# EAGLE design GS_module (EAGLE 7.3.0)
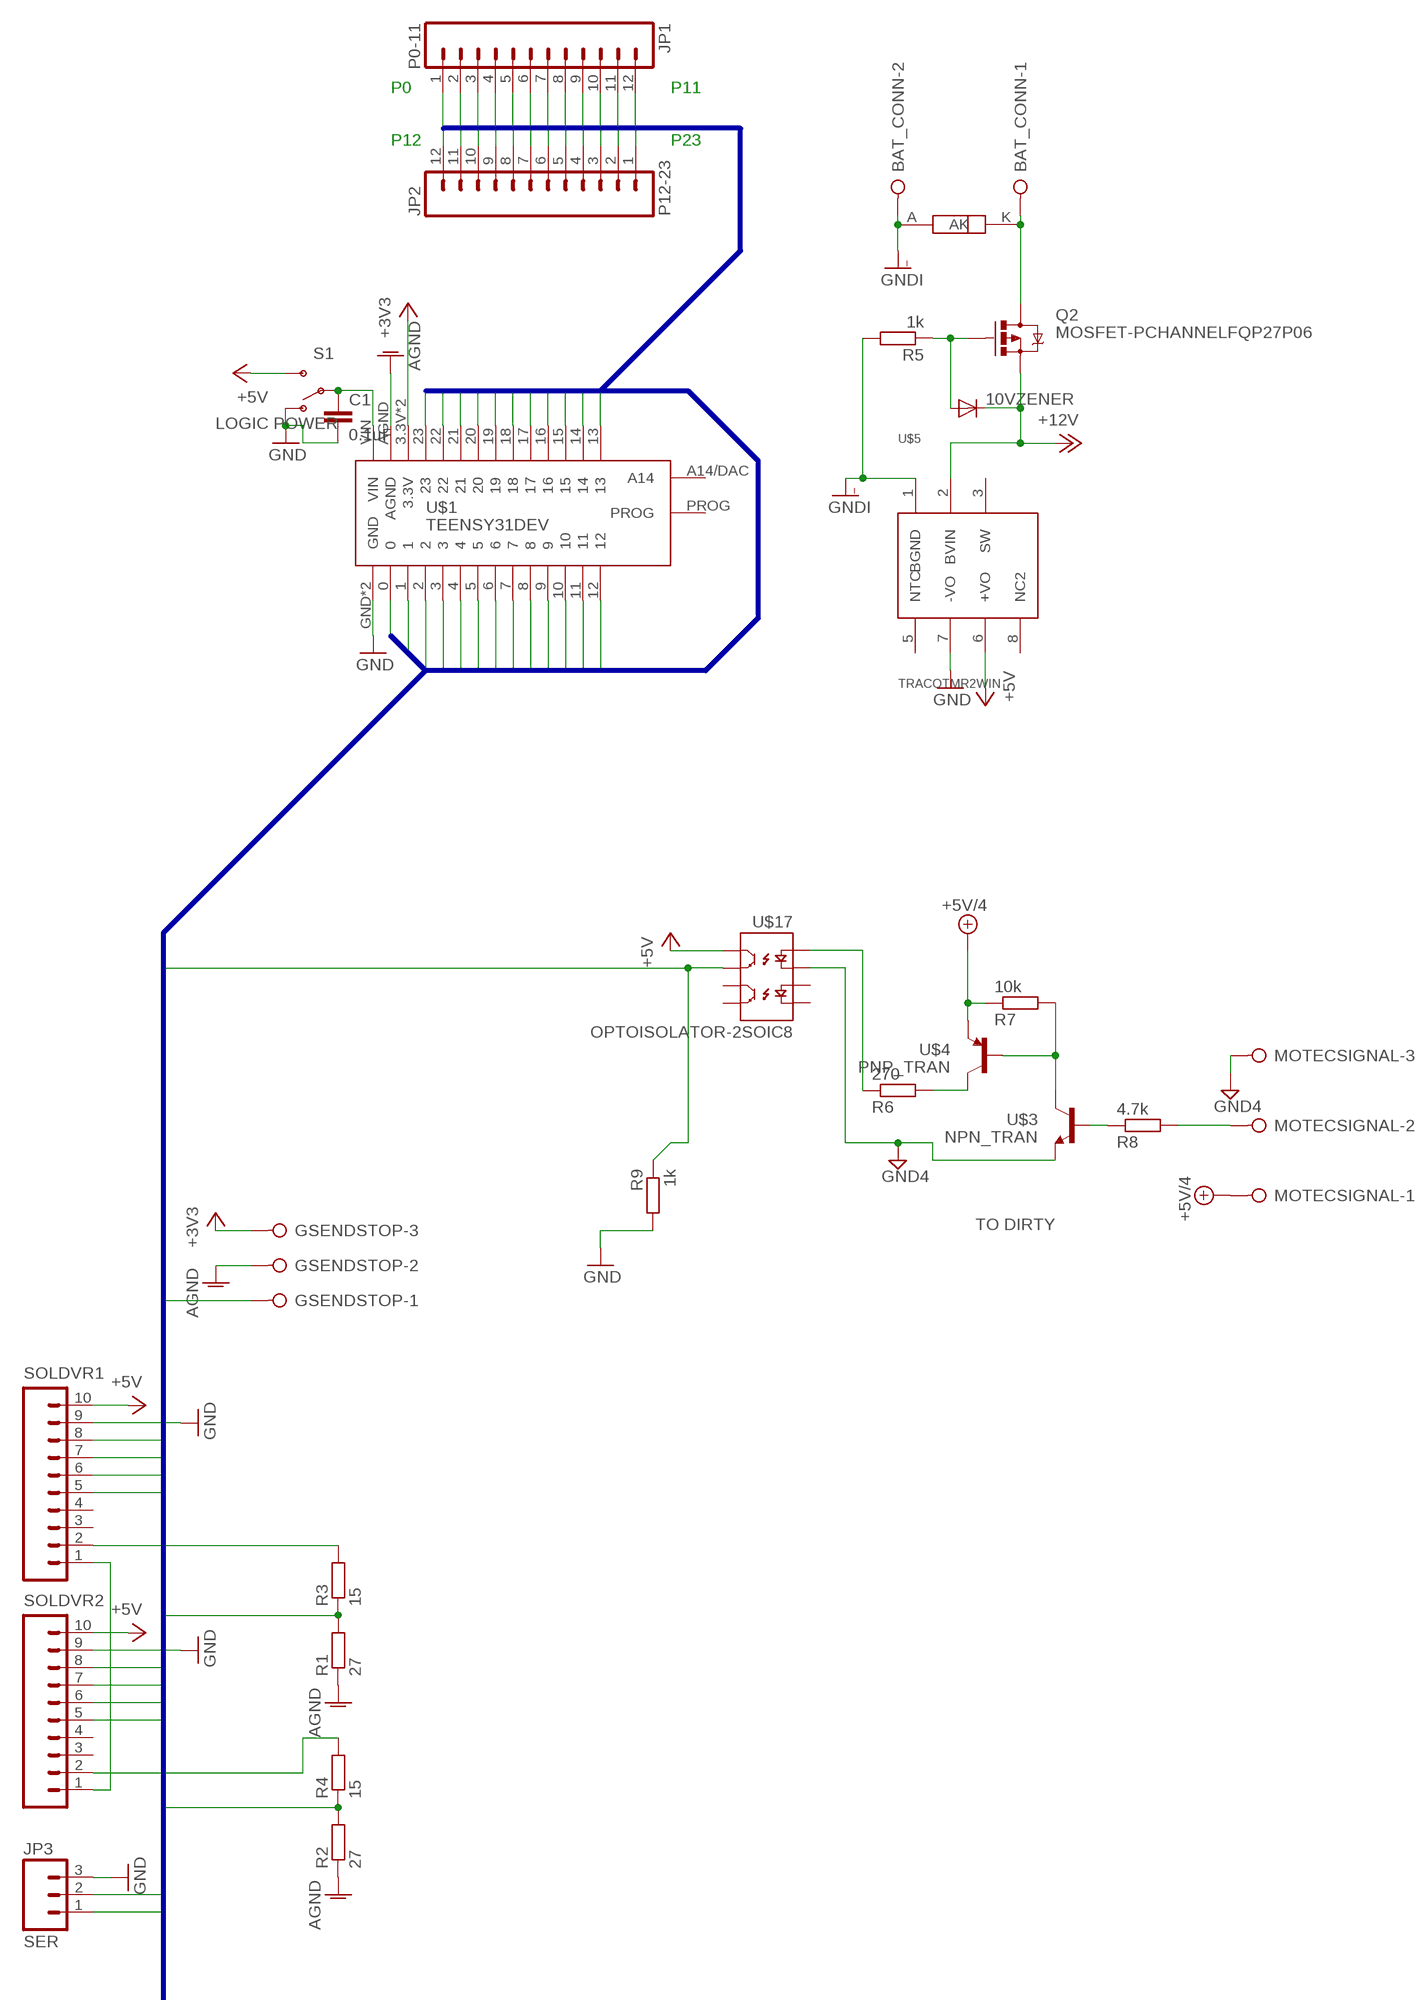
[diagram p0: schematic, sheet 1, part 1 of 2]
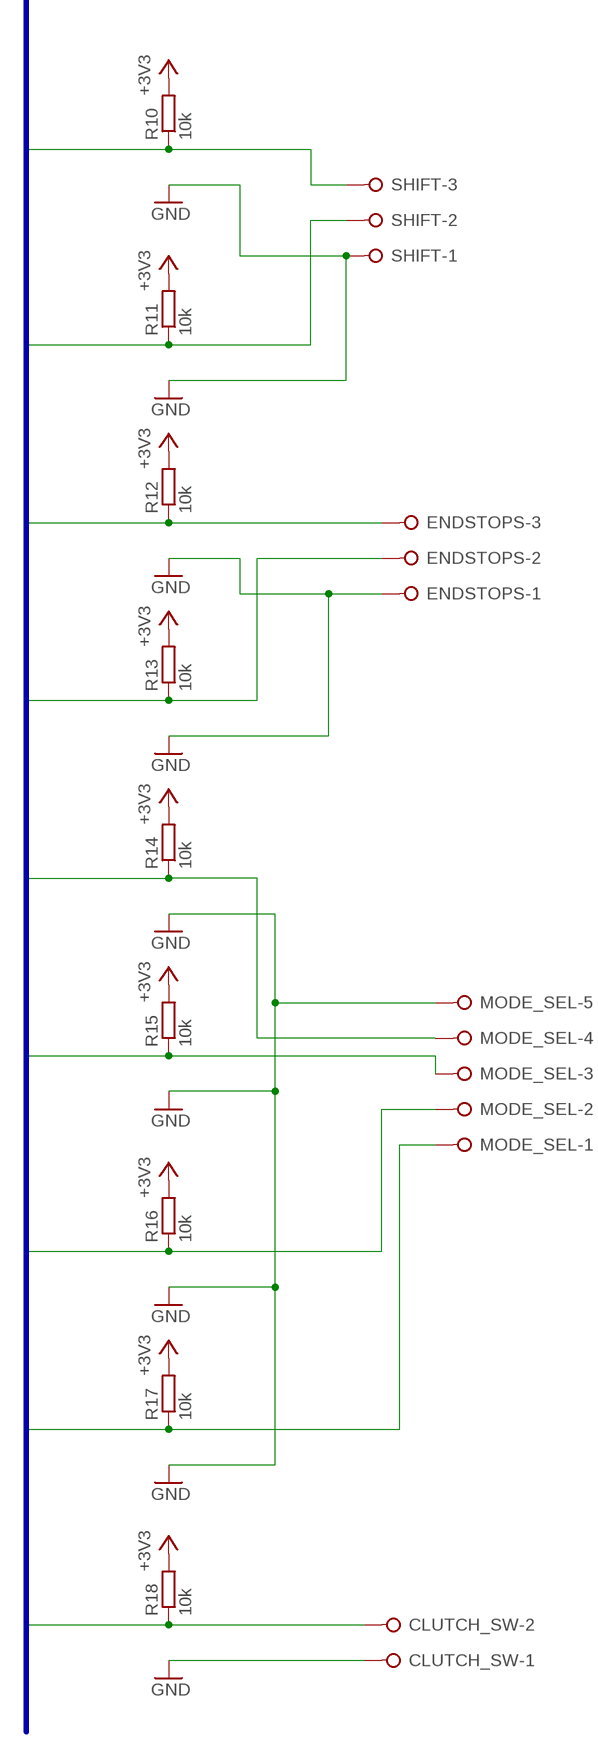
[diagram p1: schematic, sheet 1, part 2 of 2]

## Parts
10VZENER  DIODE-DO214BA  [DO214BA]
BAT_CONN  W237-02P  [W237-132]
C1  0.1uF  C-EUC1206  [C1206]
CLUTCH_SW  W237-02P  [W237-132]
ENDSTOPS  W237-03P  [W237-133]
GSENDSTOP  W237-03P  [W237-133]
JP1  P0-11  M12LOCK  [1X12_LOCK]
JP2  P12-23  M12LOCK  [1X12_LOCK]
JP3  SER  M03POLAR_LOCK  [MOLEX-1X3_LOCK]
MODE_SEL  W237-05P  [W237-5P]
MOTECSIGNAL  W237-03P  [W237-133]
Q2  MOSFET-PCHANNELFQP27P06  [TO220V]
R1  27  R-EU_R1206  [R1206]
R2  27  R-EU_R1206  [R1206]
R3  15  R-EU_R1206  [R1206]
R4  15  R-EU_R1206  [R1206]
R5  1k  R-EU_R1206  [R1206]
R6  270  R-EU_R1206  [R1206]
R7  10k  R-EU_R1206  [R1206]
R8  4.7k  R-EU_R1206  [R1206]
R9  1k  R-EU_R1206  [R1206]
R10  10k  R-EU_R1206  [R1206]
R11  10k  R-EU_R1206  [R1206]
R12  10k  R-EU_R1206  [R1206]
R13  10k  R-EU_R1206  [R1206]
R14  10k  R-EU_R1206  [R1206]
R15  10k  R-EU_R1206  [R1206]
R16  10k  R-EU_R1206  [R1206]
R17  10k  R-EU_R1206  [R1206]
R18  10k  R-EU_R1206  [R1206]
S1  LOGIC POWER  SWITCH-SPDTKIT  [SWITCH-SPDT_KIT]
SHIFT  W237-03P  [W237-133]
SOLDVR1  M10LOCK  [1X10_LOCK]
SOLDVR2  M10LOCK  [1X10_LOCK]
U$1  TEENSY31DEV  [TEENSY31PAC]
U$3  NPN_TRAN  [SOT23-3]
U$4  PNP_TRAN  [SOT23-3]
U$5  TRACOTMR2WIN  [TRACOPOWERDC-DCTRM2WIN]
U$6  LNBTVS  [JEDECDO-214AB]
U$17  OPTOISOLATOR-2SOIC8  [SO08-2]

## Nets
+3V3: GSENDSTOP.3 R10.2 R11.2 R12.2 R13.2 R14.2 R15.2 R16.2 R17.2 R18.2 U$1.3.3V U$1.3.3VV(3.3V)
+5V: S1.3(S) SOLDVR1.10 SOLDVR2.10 U$5.6(+VO) U$17.8(CL1)
+5V/4: MOTECSIGNAL.1 R7.1 U$4.2(E)
+12V: 10VZENER.C Q2.3(S) U$5.2(BVIN)
AGND: GSENDSTOP.2 R1.1 R2.1 U$1.AGND
GND: C1.2 CLUTCH_SW.1 ENDSTOPS.1 JP3.3 MODE_SEL.5 R9.2 S1.1(O) SHIFT.1 SOLDVR1.9 SOLDVR2.9 U$1.GND U$1.GND2(GND) U$5.7(-VO)
GND4: MOTECSIGNAL.3 U$3.2(E) U$17.2(C1)
GNDI: BAT_CONN.2 R5.2 U$5.1(BGND) U$6.A
N$1: R7.2 U$3.3(C) U$4.1(B)
N$2: C1.1 S1.2(P) U$1.VIN
N$3: R3.2 SOLDVR1.2
N$4: R6.1 U$17.1(A1)
N$5: R4.2 SOLDVR2.2
N$6: R6.2 U$4.3(C)
N$7: 10VZENER.A Q2.1(G) R5.1
N$8: R8.1 U$3.1(B)
N$9: MOTECSIGNAL.2 R8.2
N$10: SOLDVR1.1 SOLDVR2.1
N$13: BAT_CONN.1 Q2.2(D) U$6.K
P0: JP1.1 JP3.1 U$1.0
P1: JP1.2 JP3.2 U$1.1
P2: JP1.3 SOLDVR1.5 U$1.2
P3: JP1.4 SOLDVR1.8 U$1.3
P4: JP1.5 SOLDVR1.7 U$1.4
P5: JP1.6 SOLDVR1.6 U$1.5
P6: CLUTCH_SW.2 JP1.7 R18.1 U$1.6
P7: JP1.8 SOLDVR2.5 U$1.7
P8: JP1.9 SOLDVR2.8 U$1.8
P9: JP1.10 SOLDVR2.7 U$1.9
P10: JP1.11 SOLDVR2.6 U$1.10
P11: JP1.12 R10.1 SHIFT.3 U$1.11
P12: JP2.12 R11.1 SHIFT.2 U$1.12
P13: JP2.11 R9.1 U$1.13 U$17.7(EM1)
P14: GSENDSTOP.1 JP2.10 U$1.14
P15: JP2.9 U$1.15
P16: JP2.8 R1.2 R3.1 U$1.16
P17: ENDSTOPS.3 JP2.7 R12.1 U$1.17
P18: ENDSTOPS.2 JP2.6 R13.1 U$1.18
P19: JP2.5 R2.2 R4.1 U$1.19
P20: JP2.4 MODE_SEL.4 R14.1 U$1.20
P21: JP2.3 MODE_SEL.3 R15.1 U$1.21
P22: JP2.2 MODE_SEL.2 R16.1 U$1.22
P23: JP2.1 MODE_SEL.1 R17.1 U$1.23
Unconnected: SOLDVR1.3 SOLDVR1.4 SOLDVR2.3 SOLDVR2.4 U$1.A14/DAC(A14) U$1.PROG U$5.3(SW) U$5.5(NTC) U$5.8(NC2) U$17.3(A2) U$17.4(C2) U$17.5(EM2) U$17.6(CL2)

## Buses
P[0..23]

## Notes on the sheet
- TO DIRTY

## Library data of the parts
10VZENER = diode:DIODE-: DIODE
BAT_CONN CLUTCH_SW = con-wago-508:W237-02P: WAGO SREW CLAMP; OC_FARNELL: unknown; OC_NEWARK: unknown
C1 = resistor:C-EU: CAPACITOR, European symbol
ENDSTOPS GSENDSTOP MOTECSIGNAL SHIFT = con-wago-508:W237-03P: WAGO SREW CLAMP; OC_FARNELL: unknown; OC_NEWARK: unknown
JP1 JP2 = SparkFun-Connectors:M12: Header 12 Standard 12-pin 0.1" header. Use with straight break away headers (SKU : PRT-00116), right angle break away headers (PRT-00553), swiss pins (PRT-00743), machine pins (PRT-00117), and female headers (PRT-00115).
JP3 = SparkFun-Connectors:M03: Header 3 Standard 3-pin 0.1" header. Use with straight break away headers (SKU : PRT-00116), right angle break away headers (PRT-00553), swiss pins (PRT-00743), machine pins (PRT-00117), and female headers (PRT-00115). Molex polarized connector foot print use with SKU : PRT-08232 with associated crimp pins and housings.
MODE_SEL = con-wago-508:W237-05P: WAGO SREW CLAMP; OC_FARNELL: unknown; OC_NEWARK: unknown
Q2 = SparkFun-DiscreteSemi:MOSFET-PCHANNEL: Generic PMOSFET IRLML2244 - TRANS-11153 (SOT-23 -20V -4.3A) (1.Gate 2.Source 3.Drain) FQP27P06 - COM-10349 <http://www.sparkfun.com/products/10349> (TO-220 -60V -27A) (1.Gate 2.Source 3.Drain)
R1-R5 R10-R18 = rcl:R-EU_: RESISTOR, European symbol
R6-R9 = resistor:R-EU_: RESISTOR, European symbol
S1 = SparkFun-Electromechanical:SWITCH-SPDT: SPDT Switch Simple slide switch, Spark Fun Electronics SKU : COM-00102 DPDT SMT slide switch, AYZ0202, SWCH-08179; PROD_ID: SWCH-08261
SOLDVR1 SOLDVR2 = SparkFun-Connectors:M10: Header 10 Standard 10-pin 0.1" header. Use with straight break away headers (SKU : PRT-00116), right angle break away headers (PRT-00553), swiss pins (PRT-00743), machine pins (PRT-00117), and female headers (PRT-00115).
U$1 = custom:TEENSY31DEV: TEENSY 3.1 uC headers
U$3 = custom:NPN_TRAN
U$4 = custom:PNP_TRAN
U$5 = custom:TRACOTMR2WIN
U$6 = custom:LNBTVS
U$17 = SparkFun-DiscreteSemi:OPTOISOLATOR-2: Description: Dual gate opto isolator. Vishay part : ILD213T; PROD_ID: IC-09076

## Board
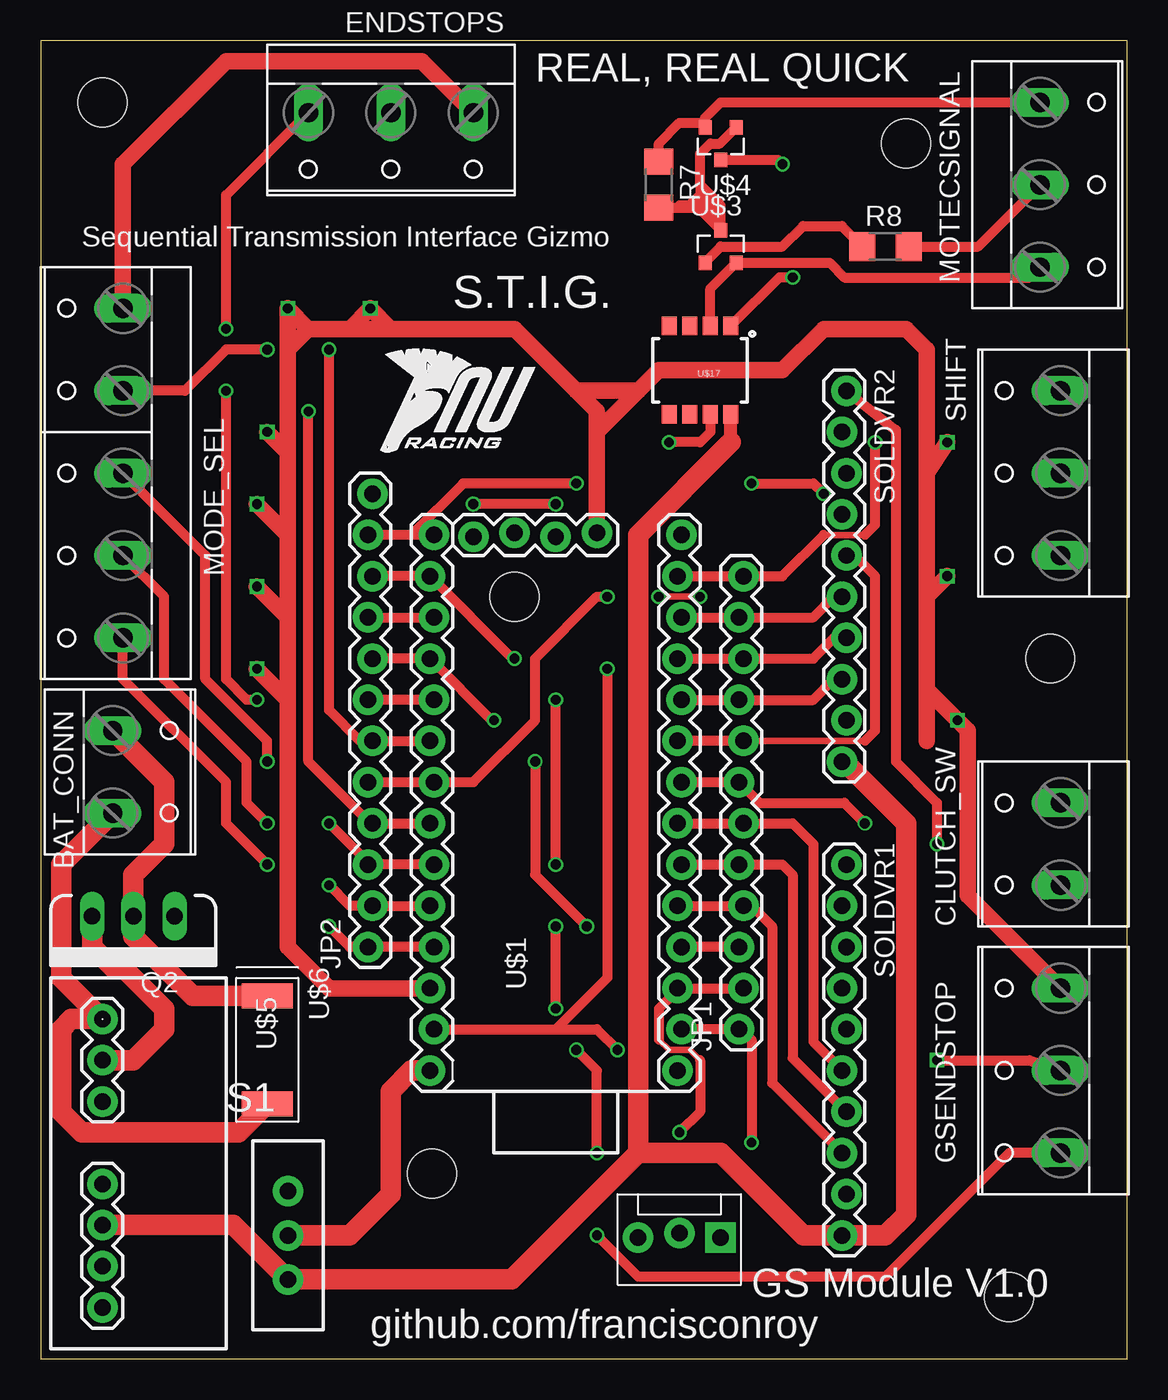
[diagram p2: board, top side]
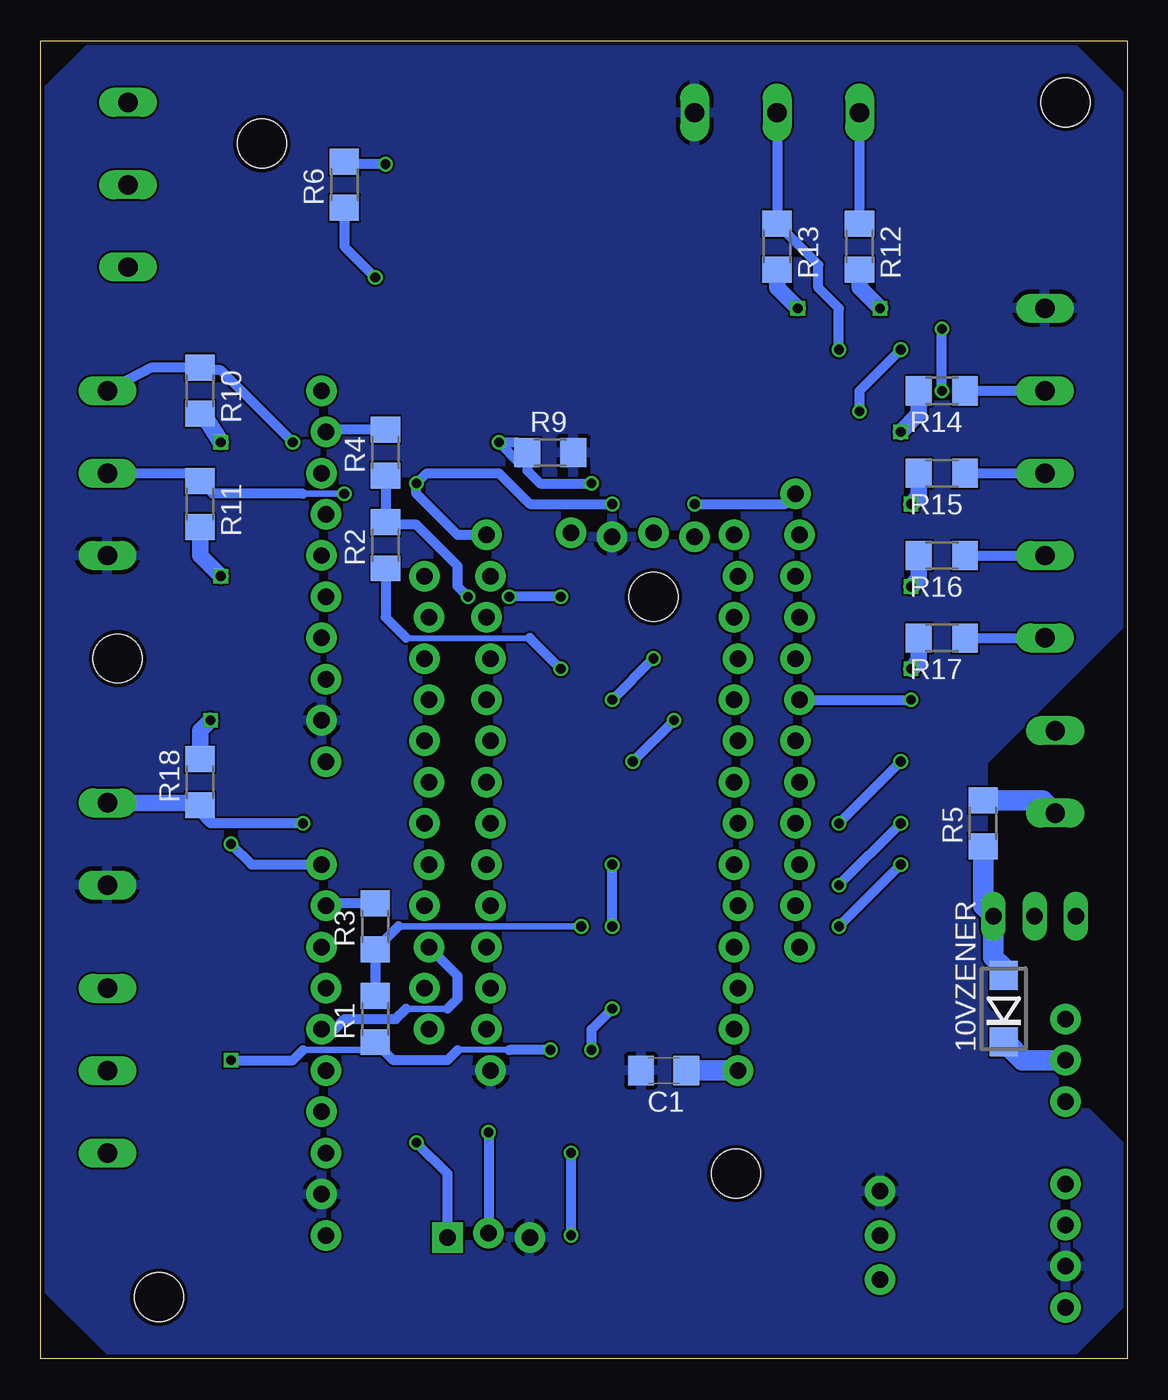
[diagram p3: board, bottom side, seen from below]

Size 66.98 x 81.28 mm. Coordinates in mm from the lower left corner, seen from the top.
Outline: 0,0 66.98,0 66.98,81.28 0,81.28 0,0
Copper layers (1*16): Top 0.035mm / dielectric 1.5mm / Bottom 0.035mm
Design rules "dirt_cheap_dirty_boards.v1": minimum track width 5mil, minimum drill 12mil, track to track 5mil, track to pad 5mil, pad to pad 5mil, via to via 5mil, smd to smd 0mil, copper to edge 10mil, drill to drill 10mil, minimum pad ring 10mil, minimum via ring 6mil, stop-mask expansion 2mil, vias tented up to drill 25mil, thermal gap 10mil
Holes 3 mm at 3.81,77.47 62.23,43.18 53.34,74.93 29.21,46.99 24.13,11.43 59.69,3.81

### Footprints (pad centres in the part's own frame; a part is rotated, then mirrored left to right if it is on the bottom)
DO214BA = smd 1.8 x 1.7: A 2.05,0; C -2.05,0
W237-132 = drill 1.194 long: 1 -2.54,-0.635; 2 2.54,-0.635
C1206 = smd 1.6 x 1.8: 1 -1.4,0; 2 1.4,0
W237-133 = drill 1.194 long: 1 -5.08,-0.635; 2 0,-0.635; 3 5.08,-0.635
1X12_LOCK = drill 1.016 pad 1.88: 1 0,0.127; 2 2.54,-0.127; 3 5.08,0.127; 4 7.62,-0.127; 5 10.16,0.127; 6 12.7,-0.127; 7 15.24,0.127; 8 17.78,-0.127; 9 20.32,0.127; 10 22.86,-0.127; 11 25.4,0.127; 12 27.94,-0.127
MOLEX-1X3_LOCK = drill 1.016 pad 1.88 square: 1 0,0.127 | drill 1.016 pad 1.88: 2 2.54,-0.127; 3 5.08,0.127
W237-5P = drill 1.194 long: 1 -10.16,-0.635; 2 -5.08,-0.635; 3 0,-0.635; 4 5.08,-0.635; 5 10.16,-0.635
TO220V = drill 1.016 long: 1 -2.54,0; 2 0,0; 3 2.54,0
R1206 = smd 1.6 x 1.803: 1 -1.422,0; 2 1.422,0
SWITCH-SPDT_KIT = drill 1.016 pad 1.88: 1 0,2.718; 2 0,0; 3 0,-2.718
1X10_LOCK = drill 1.016 pad 1.88: 1 0,0.127; 2 2.54,-0.127; 3 5.08,0.127; 4 7.62,-0.127; 5 10.16,0.127; 6 12.7,-0.127; 7 15.24,0.127; 8 17.78,-0.127; 9 20.32,0.127; 10 22.86,-0.127
TEENSY31PAC = drill 1.016 pad 1.88: 0 -13.97,-6.477; 1 -11.43,-6.223; 2 -8.89,-6.477; 3 -6.35,-6.223; 3.3V 16.637,-1.27; 3.3VV -11.43,9.017; 4 -3.81,-6.477; 5 -1.27,-6.223; 6 1.27,-6.477; 7 3.81,-6.223; 8 6.35,-6.477; 9 8.89,-6.223; 10 11.43,-6.477; 11 13.97,-6.223; 12 16.51,-6.477; 13 16.51,8.763; 14 13.97,9.017; 15 11.43,8.763; 16 8.89,9.017; 17 6.35,8.763; 18 3.81,9.017; 19 1.27,8.763; 20 -1.27,9.017; 21 -3.81,8.763; 22 -6.35,9.017; 23 -8.89,8.763; A14/DAC 16.383,6.35; AGND -13.97,8.763; GND -16.51,-6.223; GND2 16.383,1.27; PROG 16.637,3.81; VIN -16.51,9.017
SOT23-3 = smd 0.8 x 0.9: 1 -0.95,-1; 2 0.95,-1; 3 0,1
TRACOPOWERDC-DCTRM2WIN = drill 1.016 pad 1.88: 1 -8.89,0; 2 -6.35,0; 3 -3.81,0; 5 1.27,0; 6 3.81,0; 7 6.35,0; 8 8.89,0
JEDECDO-214AB = smd 1.549 x 3.15: A 3.327,0; K -3.327,0
SO08-2 = smd 0.914 x 1.143: 1 -1.905,-2.731; 2 -0.635,-2.731; 3 0.635,-2.731; 4 1.905,-2.731; 5 1.905,2.731; 6 0.635,2.731; 7 -0.635,2.731; 8 -1.905,2.731

### Placement (x,y rotation side)
10VZENER  7.62,21.59 90 bottom
BAT_CONN  5.08,36.2 270 top
C1  28.57,17.78 180 bottom
CLUTCH_SW  62.23,31.75 90 top
ENDSTOPS  21.59,76.2 180 top
GSENDSTOP  62.23,17.78 90 top
JP1  43.18,20.32 90 top
JP2  20.32,25.4 90 top
JP3  41.91,7.62 180 top
MODE_SEL  4.45,54.61 90 top
MOTECSIGNAL  62.23,72.39 270 top
Q2  5.71,27.3 180 top
R1  46.35,20.95 90 bottom
R2  45.72,50.16 90 bottom
R3  46.35,26.67 90 bottom
R4  45.72,55.88 90 bottom
R5  8.89,33.02 90 bottom
R6  48.26,72.39 90 bottom
R7  38.1,72.39 270 top
R8  52.07,68.58 0 top
R9  35.56,55.88 0 bottom
R10  57.15,59.69 270 bottom
R11  57.15,52.7 270 bottom
R12  16.51,68.58 270 bottom
R13  21.59,68.58 270 bottom
R14  11.43,59.69 180 bottom
R15  11.43,54.61 180 bottom
R16  11.43,49.53 180 bottom
R17  11.43,44.45 180 bottom
R18  57.15,35.56 90 bottom
S1  15.24,7.62 0 top
SHIFT  62.23,54.61 90 top
SOLDVR1  49.53,30.48 270 top
SOLDVR2  49.53,59.69 270 top
U$1  33.02,34.29 90 top
U$2  [NURLOGO]  20.95,55.88 0 top
U$3  41.91,68.58 0 top
U$4  41.91,74.93 180 top
U$5  3.81,12.06 270 top
U$6  13.97,19.05 270 top
U$17  40.64,60.96 180 top

### Tracks (layer width: path | path; a pad name or v marks a point on that pad's centre or on a via)
+3V3  (via drill 0.6)
  Top 1.016: U$1.3.3VV 17.78,22.86 15.24,25.4 15.24,40.64 | 15.24,40.64 15.24,45.72 | 15.24,45.72 15.24,50.8 | 15.24,50.8 15.24,55.88 | 15.24,55.88 15.24,62.23 | 15.24,62.23 16.51,63.5 | 16.51,63.5 19.05,63.5 | v13.97,57.15 15.24,55.88 | v13.34,52.7 15.24,50.8 | v13.34,47.62 15.24,45.72 | v13.34,42.55 15.24,40.64 | 15.24,62.23 v15.24,64.77 16.51,63.5 | 19.05,63.5 v20.32,64.77 21.59,63.5 | U$1.3.3V 34.29,57.15 | 34.29,57.15 36.83,59.69 | 36.83,59.69 38.1,60.96 45.72,60.96 48.26,63.5 53.34,63.5 54.61,62.23 54.61,54.61 | 54.61,54.61 54.61,46.99 | 54.61,46.99 54.61,41.27 | 54.61,41.27 54.61,38.1 | v55.88,48.26 54.61,46.99 | v55.88,56.52 54.61,54.61 | 54.61,41.27 v56.52,39.37 57.15,38.73 57.15,28.57 GSENDSTOP.3 | 34.29,57.15 34.29,58.42 33.02,59.69 | 33.02,59.69 29.21,63.5 21.59,63.5 | 21.59,63.5 19.05,63.5 | 36.83,59.69 33.02,59.69
  Bottom 1.016: R14.2 12.85,58.27 v13.97,57.15 | R15.2 12.85,53.19 v13.34,52.7 | R16.2 12.85,48.11 v13.34,47.62 | R17.2 12.85,43.03 v13.34,42.55 | R12.2 16.51,66.04 v15.24,64.77 | R13.2 21.59,66.04 v20.32,64.77 | R11.2 57.15,49.53 v55.88,48.26 | R10.2 57,58.27 v55.88,56.52 | R18.2 57.15,38.73 v56.52,39.37
+5V
  Top 0.813: 42.55,56.52 U$17.8
  Top 1.27: U$5.6 11.89,8.26 S1.3 29.03,4.9 36.83,12.7 | 36.83,12.7 36.83,50.8 42.55,56.52 | 36.83,12.7 41.91,12.7 46.99,7.62 SOLDVR1.10 52.07,7.62 53.34,8.89 53.34,33.02 49.53,36.83 SOLDVR2.10
+5V/4
  Top 0.61: R7.1 38.1,74.93 39.37,76.2 40.69,76.2 U$4.2 40.96,76.52 41.91,77.47 MOTECSIGNAL.1
+12V
  Top 1.27: Q2.3 3.17,25.4 4.45,24.13 5.08,24.13 7.62,21.59 7.62,20.32 5.71,18.41 U$5.2
  Bottom 1.27: 6.5,18.41 10VZENER.C 7.47,19.54 6.35,18.41 U$5.2
AGND  (via drill 0.6)
  Top 0.61: U$1.AGND 31.75,20.32 | 31.75,20.32 34.29,20.32 v35.56,19.05 | v34.92,42.55 34.92,23.5 31.75,20.32 | v55.24,18.41 60.96,18.41 GSENDSTOP.2
  Bottom 0.381: 38.1,19.05 41.27,19.05 | 44.45,44.45 36.83,44.45
  Bottom 0.406: 50.8,19.05 46.84,19.05
  Bottom 0.61: v35.56,19.05 38.1,19.05 | 41.27,19.05 41.91,18.41 45.24,18.41 R1.1 46.84,19.05 | R2.1 45.72,45.72 44.45,44.45 | 36.83,44.45 v34.92,42.55 | v55.24,18.41 51.44,18.41 50.8,19.05
GND
  Top 1.016: MODE_SEL.5 5.08,73.66 11.43,80.01 23.5,80.01 ENDSTOPS.1
  pour Bottom: 0,12.7 8.89,21.59 8.89,35.56 8.89,36.83 0,45.72 0,77.47 3.81,81.28 63.5,81.28 67.31,77.47 67.31,5.08 62.23,0 3.81,0 0,3.81
GND4
  Top 0.61: U$17.2 41.27,66 U$3.2 48.62,67.58 49.53,66.67 60.96,66.67 MOTECSIGNAL.3
GNDI
  Top 1.27: BAT_CONN.2 1.27,30.48 1.27,23.5 U$5.1 1.91,20.95 1.27,20.32 1.27,15.24 2.54,13.97 12.22,13.97 U$6.A
  Bottom 1.27: R5.2 5.23,34.44 BAT_CONN.2
N$1
  Top 0.61: R7.2 40.52,70.97 U$3.3 41.91,70.48 | 41.91,70.48 41.91,71.12 40.64,72.39 | 40.64,72.39 40.64,74.3 41.27,74.93 41.86,74.93 U$4.1 | 40.64,72.39 40.64,71.75 | 40.64,71.75 41.91,70.48 | 41.91,70.48 41.27,70.48 40.64,71.12 | 39.37,71.12 40.01,71.12 40.64,71.75
N$2
  Top 1.27: 24.13,17.65 U$1.VIN 22.86,17.78 21.59,16.51 21.59,10.16 19.05,7.62 S1.2
  Bottom 1.27: C1.1 U$1.VIN
N$3
  Bottom 0.61: R3.2 49.25,28.09 SOLDVR1.2
N$4  (via drill 0.6)
  Top 0.61: v46.35,66.67 45.53,66.67 U$17.1
  Bottom 0.61: R6.1 48.26,68.58 v46.35,66.67
N$5
  Bottom 0.61: R4.2 49.25,57.3 SOLDVR2.2
N$6  (via drill 0.6)
  Top 0.61: U$4.3 45.45,73.93 v45.72,73.66
  Bottom 0.61: v45.72,73.66 48.11,73.66 R6.2
N$7
  Bottom 1.27: R5.1 8.89,27.94 Q2.1 8.26,24.77 7.62,24.13 10VZENER.A
N$8
  Top 0.61: U$3.1 40.96,67.63 41.91,68.58 45.72,68.58 46.99,69.85 49.38,69.85 R8.1
N$9
  Top 0.61: R8.2 57.78,68.58 MOTECSIGNAL.2
N$10  (via drill 0.6)
  Top 0.61: SOLDVR2.1 52.7,57.28 52.7,36.83 55.24,34.29 v55.24,31.75
  Bottom 0.61: v55.24,31.75 53.98,30.48 SOLDVR1.1
N$13
  Top 1.27: BAT_CONN.1 7.62,35.56 7.62,31.75 5.71,29.84 Q2.2 5.71,26.04 9.37,22.38 U$6.K
P0  (via drill 0.6)
  Top 0.61: U$1.0 JP1.1 43.18,20.32 43.81,19.68 v43.81,13.34
  Bottom 0.61: v43.81,13.34 41.91,11.43 JP3.1
P1  (via drill 0.6)
  Top 0.406: 38.1,19.68 38.73,19.05 40.01,19.05 40.64,18.41
  Top 0.61: JP1.2 U$1.1 39.24,22.73 38.1,21.59 38.1,19.68 | 40.64,18.41 40.64,15.24 v39.37,13.97
  Bottom 0.61: v39.37,13.97 JP3.2
P2
  Top 0.61: JP1.3 U$1.2
  Bottom 0.406: 44.45,21.59 41.91,21.59
  Bottom 0.61: SOLDVR1.5 48.9,20.32 48.26,20.95 45.09,20.95 44.45,21.59 | 41.91,21.59 41.27,22.23 41.27,23.62 JP1.3
P3
  Top 0.61: U$1.3 JP1.4 43.81,27.94 45.09,26.67 45.09,17.02 SOLDVR1.8
P4
  Top 0.61: U$1.4 JP1.5 45.72,30.48 46.35,29.84 46.35,18.54 SOLDVR1.7
P5
  Top 0.61: U$1.5 JP1.6 46.35,33.02 47.62,31.75 47.62,19.56 SOLDVR1.6
P6  (via drill 0.6)
  Top 0.61: U$1.6 JP1.7 44.32,34.29 49.53,34.29 v50.8,33.02
  Bottom 0.61: v50.8,33.02 56.52,33.02 57.15,33.66 R18.1
  Bottom 1.016: CLUTCH_SW.2 57.3,34.29 R18.1
P7
  Top 0.406: JP1.8 50.8,38.1
  Top 0.61: JP1.8 U$1.7 | 50.8,38.1 51.44,38.73 51.44,48.26 50.16,49.53 SOLDVR2.5
P8
  Top 0.61: U$1.8 JP1.9 47.62,40.64 48.9,41.91 SOLDVR2.8
P9
  Top 0.61: U$1.9 JP1.10 47.62,43.18 48.9,44.45 SOLDVR2.7
P10
  Top 0.61: U$1.10 JP1.11 47.62,45.72 48.9,46.99 SOLDVR2.6
P11  (via drill 0.6)
  Top 0.406: 48.26,50.8 50.8,50.8
  Top 0.61: U$1.11 JP1.12 45.72,48.26 48.26,50.8 | 50.8,50.8 51.44,51.44 v51.44,56.52
  Bottom 0.61: v51.44,56.52 55.88,60.96 57,60.96 R10.1 60.17,61.11 SHIFT.3
P12  (via drill 0.6)
  Top 0.61: v31.75,52.7 v26.67,52.7 | v43.81,53.98 47.62,53.98 v48.26,53.34
  Bottom 0.406: v48.26,53.34 50.8,53.34
  Bottom 0.61: U$1.12 41.27,50.8 43.81,53.34 v43.81,53.98 43.18,54.61 38.73,54.61 36.83,52.7 v31.75,52.7 | v26.67,52.7 21.08,52.7 JP2.12 | SHIFT.2 57.63,54.61 R11.1 56.36,53.34 50.8,53.34
P13  (via drill 0.6)
  Top 0.61: U$17.7 41.27,57.15 40.64,56.52 v38.73,56.52 | v33.02,53.98 26.04,53.98 22.86,50.8 | 24.13,50.93 U$1.13 22.86,50.8 | 22.86,50.8 JP2.11
  Bottom 0.61: v33.02,53.98 36.2,53.98 36.98,54.76 R9.1 37.62,56.52 v38.73,56.52 37.47,55.24
P14  (via drill 0.6)
  Top 0.61: JP2.10 U$1.14 29.08,43.18 v29.21,43.18 | GSENDSTOP.1 59.69,12.7 52.07,5.08 36.83,5.08 v34.29,7.62 | v34.29,12.7 34.29,17.78 v33.02,19.05 | v31.75,21.59 v31.75,26.67 | v31.75,30.48 v31.75,40.64
  Bottom 0.61: v34.29,7.62 v34.29,12.7 | v33.02,19.05 33.02,20.32 v31.75,21.59 | v31.75,26.67 v31.75,30.48 | v31.75,40.64 v29.21,43.18
P15
  Top 0.61: JP2.9 U$1.15
P16  (via drill 0.6)
  Top 0.61: JP2.8 U$1.16 27.81,39.37 v27.94,39.37 | v30.48,36.83 30.48,29.84 v33.66,26.67
  Bottom 0.406: v33.66,26.67 44.93,26.67
  Bottom 0.61: R1.2 R3.1 44.93,26.67 | v27.94,39.37 v30.48,36.83
P17  (via drill 0.6)
  Top 0.61: U$1.17 JP2.7 | v13.34,40.64 12.7,40.64 11.43,41.91 v11.43,59.69 | v11.43,63.5 11.43,71.75 ENDSTOPS.3
  Bottom 0.61: R12.1 ENDSTOPS.3 | JP2.7 v13.34,40.64 | v11.43,59.69 v11.43,63.5
P18  (via drill 0.6)
  Top 0.61: U$1.18 JP2.6 19.68,38.1 17.78,40.01 v17.78,62.23
  Bottom 0.61: ENDSTOPS.2 R13.1 19.05,67.46 19.05,66.04 17.78,64.77 v17.78,62.23
P19  (via drill 0.6)
  Top 0.406: v38.1,46.99 v40.64,46.99
  Top 0.61: JP2.5 U$1.19 26.67,35.56 30.48,39.37 30.48,43.18 34.29,46.99 v34.92,46.99
  Bottom 0.61: R4.1 R2.2 45.57,51.44 43.81,51.44 41.27,48.9 41.27,47.62 v40.64,46.99 | v34.92,46.99 v38.1,46.99
P20  (via drill 0.6)
  Top 0.61: U$1.20 JP2.4 20.32,33.02 16.51,36.83 v16.51,58.42 | v13.97,62.23 11.43,62.23 8.89,59.69 MODE_SEL.4
  Bottom 0.61: R14.1 MODE_SEL.4 | v16.51,58.42 16.51,59.69 v13.97,62.23
P21  (via drill 0.6)
  Top 0.61: U$1.21 JP2.3 20.19,30.61 v17.78,33.02 | v13.97,36.83 13.97,38.1 10.16,41.91 10.16,49.53 MODE_SEL.3
  Bottom 0.61: R15.1 MODE_SEL.3 | v17.78,33.02 v13.97,36.83
P22  (via drill 0.6)
  Top 0.61: U$1.22 JP2.2 19.05,27.94 v17.78,29.21 | v13.97,33.02 12.7,34.29 12.7,36.83 7.62,41.91 7.62,46.99 MODE_SEL.2
  Bottom 0.61: R16.1 MODE_SEL.2 | v17.78,29.21 v13.97,33.02
P23  (via drill 0.6)
  Top 0.61: U$1.23 JP2.1 19.05,25.4 v17.78,26.67 | v13.97,30.48 11.43,33.02 11.43,35.56 5.08,41.91 MODE_SEL.1
  Bottom 0.61: R17.1 MODE_SEL.1 | v17.78,26.67 v13.97,30.48

### Text on the board
tNames: REAL, REAL QUICK | Sequential Transmission Interface Gizmo | S.T.I.G. | GS Module V1.0 | github.com/francisconroy